# EAGLE schematic pcbNoJet (EAGLE 9.6.2)
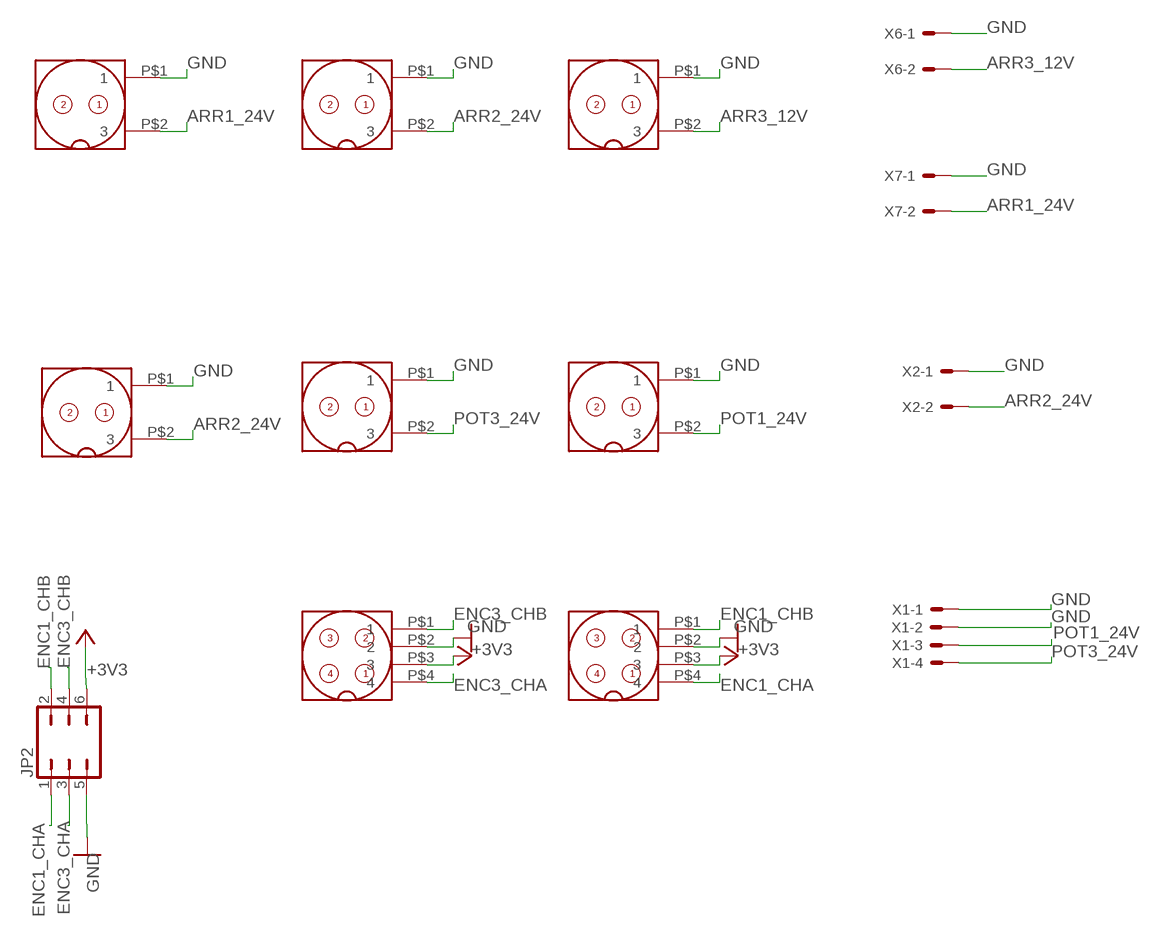
[diagram p0: schematic, sheet 1]

## Parts
JP2  JP3Q  [JP3Q]
U$1  GX16_2_PINS  [GX16_2_PINS_PADS]
U$2  GX16_4_PINS  [GX16_4_PINS_PADS]
U$3  GX16_4_PINS  [GX16_4_PINS_PADS]
U$4  GX16_2_PINS  [GX16_2_PINS_PADS]
U$5  GX16_2_PINS  [GX16_2_PINS_PADS]
U$6  GX16_2_PINS  [GX16_2_PINS_PADS]
U$8  GX16_2_PINS  [GX16_2_PINS_PADS]
U$9  GX16_2_PINS  [GX16_2_PINS_PADS]
X1  5566-45569-4  [5569-4]
X2  5566-25569-2  [5569-2]
X6  5566-25569-2  [5569-2]
X7  5566-25569-2  [5569-2]

## Nets
+3V3: JP2.6 U$2.P$3 U$3.P$3
ARR1_24V: U$4.P$2 X7.2
ARR2_24V: U$1.P$2 U$5.P$2 X2.2
ARR3_12V: U$6.P$2 X6.2
ENC1_CHA: JP2.1 U$3.P$4
ENC1_CHB: JP2.2 U$3.P$1
ENC3_CHA: JP2.3 U$2.P$4
ENC3_CHB: JP2.4 U$2.P$1
GND: JP2.5 U$1.P$1 U$2.P$2 U$3.P$2 U$4.P$1 U$5.P$1 U$6.P$1 U$8.P$1 U$9.P$1 X1.1 X1.2 X2.1 X6.1 X7.1
POT1_24V: U$9.P$2 X1.3
POT3_24V: U$8.P$2 X1.4

## Library data of the parts
JP2 = jumper:JP3Q: JUMPER
U$1 U$4-U$6 U$8 U$9 = Robocol_Eagle_Libraries:GX16_2_PINS: GX19 Reference: GX19 2 pins Type: Male Connector. Description: Aviation connector use for power connections. Rated Current: 7A Maximum working Voltage: 250 V AC RMS Author: Franz Luepke. Year: 2020 Made for use in: Robocol Uniandes.
U$2 U$3 = Robocol_Eagle_Libraries:GX16_4_PINS: GX19 Reference: GX19 4 pins Type: Male Connector. Description: Aviation connector use for power connections. Rated Current: 7A Maximum working Voltage: 250 V AC RMS Author: Franz Luepke. Year: 2020 Made for use in: Robocol Uniandes.
X1 = molex_arreglo:5566-4: Mini FIT connector 4 pol Source: http://www.molex.com
X2 X6 X7 = molex_arreglo:5566-2: Mini FIT connector 2 pol Source: http://www.molex.com